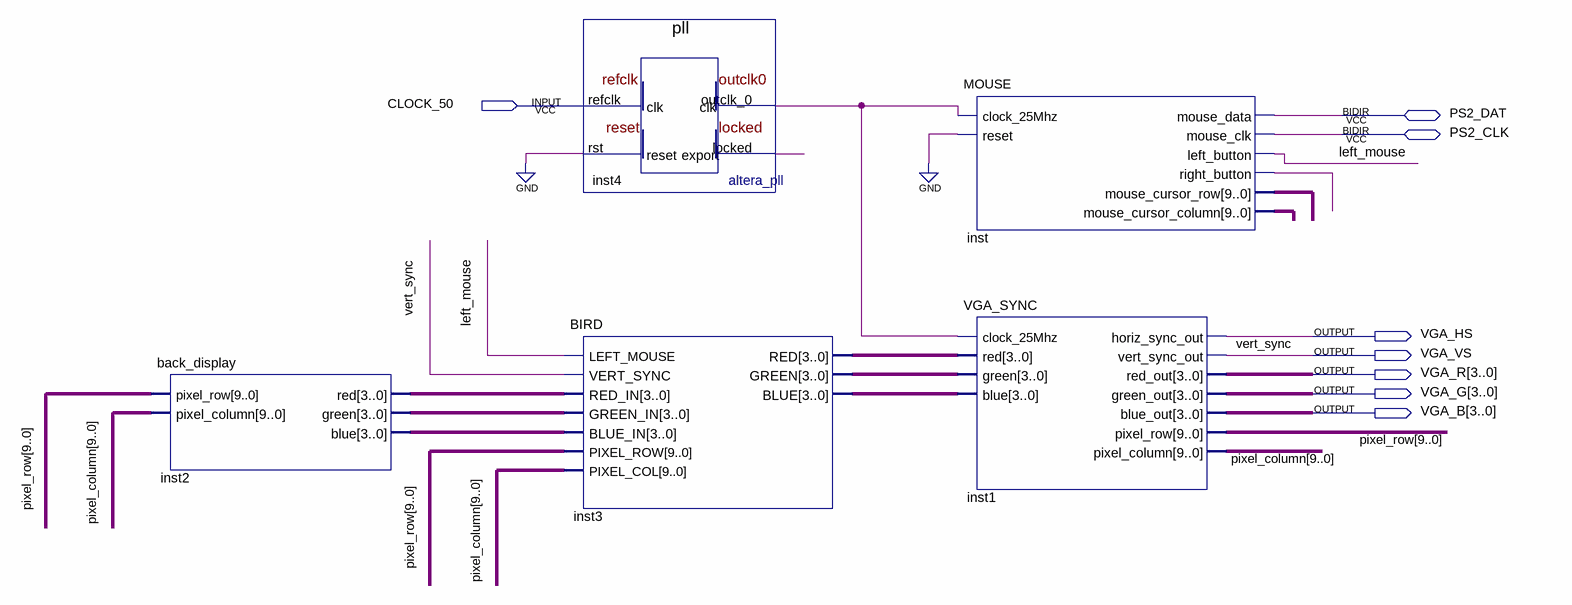
[diagram p0: schematic sheet]
// Quartus schematic bird_testing.bdf as structural Verilog: 5 symbols, 8 pins
module bird_testing (
  input  CLOCK_50,
  inout  PS2_DAT,
  inout  PS2_CLK,
  output VGA_HS,
  output VGA_VS,
  output [3:0] VGA_R,
  output [3:0] VGA_G,
  output [3:0] VGA_B
);

  wire inst4_locked, inst4_outclk_0, inst_right_button, left_mouse;
  wire [3:0] inst2_blue, inst2_green, inst2_red, inst3_blue, inst3_green, inst3_red;
  wire [9:0] inst_mouse_cursor_column, inst_mouse_cursor_row, pixel_column, pixel_row;

  back_display inst2 (
    .pixel_row(pixel_row), .pixel_column(pixel_column), .red(inst2_red), .green(inst2_green),
    .blue(inst2_blue));
  BIRD inst3 (
    .LEFT_MOUSE(left_mouse), .VERT_SYNC(VGA_VS), .RED_IN(inst2_red), .GREEN_IN(inst2_green),
    .BLUE_IN(inst2_blue), .PIXEL_ROW(pixel_row), .PIXEL_COL(pixel_column), .RED(inst3_red),
    .GREEN(inst3_green), .BLUE(inst3_blue));
  pll inst4 (.refclk(CLOCK_50), .rst(1'b0), .outclk_0(inst4_outclk_0), .locked(inst4_locked));
  MOUSE inst (
    .clock_25Mhz(inst4_outclk_0), .reset(1'b0), .left_button(left_mouse), .right_button(inst_right_button),
    .mouse_cursor_row(inst_mouse_cursor_row), .mouse_cursor_column(inst_mouse_cursor_column),
    .mouse_data(PS2_DAT), .mouse_clk(PS2_CLK));
  VGA_SYNC inst1 (
    .clock_25Mhz(inst4_outclk_0), .red(inst3_red), .green(inst3_green), .blue(inst3_blue),
    .horiz_sync_out(VGA_HS), .vert_sync_out(VGA_VS), .red_out(VGA_R), .green_out(VGA_G), .blue_out(VGA_B),
    .pixel_row(pixel_row), .pixel_column(pixel_column));

  // Other names for the same wires on the sheet: vert_sync = VGA_VS
endmodule
